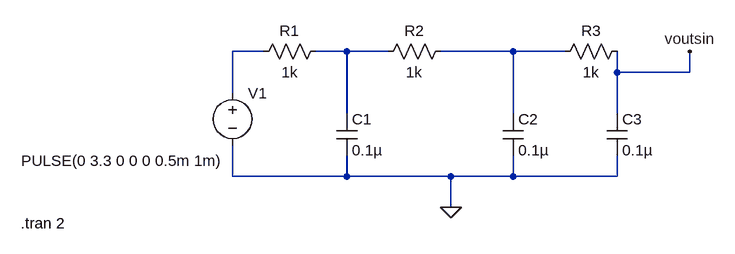
[diagram p0: schematic Draft2.asc]
Draft2.asc, the LTspice schematic file:
Version 4
SHEET 1 880 680
WIRE 0 112 -48 112
WIRE 128 112 80 112
WIRE 192 112 128 112
WIRE 384 112 272 112
WIRE 464 112 384 112
WIRE 544 144 544 112
WIRE 656 144 656 112
WIRE 656 144 544 144
WIRE -48 176 -48 112
WIRE 128 208 128 112
WIRE 384 208 384 112
WIRE 544 208 544 144
WIRE -48 304 -48 256
WIRE 128 304 128 272
WIRE 128 304 -48 304
WIRE 288 304 128 304
WIRE 384 304 384 272
WIRE 384 304 288 304
WIRE 544 304 544 272
WIRE 544 304 384 304
WIRE 288 352 288 304
FLAG 288 352 0
FLAG 656 112 voutsin
SYMBOL res 96 96 R90
WINDOW 0 0 56 VBottom 2
WINDOW 3 32 56 VTop 2
SYMATTR InstName R1
SYMATTR Value 1k
SYMBOL res 288 96 R90
WINDOW 0 0 56 VBottom 2
WINDOW 3 32 56 VTop 2
SYMATTR InstName R2
SYMATTR Value 1k
SYMBOL res 560 96 R90
WINDOW 0 0 56 VBottom 2
WINDOW 3 32 56 VTop 2
SYMATTR InstName R3
SYMATTR Value 1k
SYMBOL cap 112 208 R0
SYMATTR InstName C1
SYMATTR Value 0.1µ
SYMBOL cap 368 208 R0
SYMATTR InstName C2
SYMATTR Value 0.1µ
SYMBOL cap 528 208 R0
SYMATTR InstName C3
SYMATTR Value 0.1µ
SYMBOL voltage -48 160 R0
WINDOW 3 -325 120 Left 2
WINDOW 123 0 0 Left 0
WINDOW 39 0 0 Left 0
SYMATTR InstName V1
SYMATTR Value PULSE(0 3.3 0 0 0 0.5m 1m)
TEXT -374 376 Left 2 !.tran 2

The netlist it stands for:
* Draft2.asc
R1 N002 N001 1k
R2 N003 N002 1k
R3 voutsin N003 1k
C1 N002 0 0.1µ
C2 N003 0 0.1µ
C3 voutsin 0 0.1µ
V1 N001 0 PULSE(0 3.3 0 0 0 0.5m 1m)
.tran 2
.backanno
.end